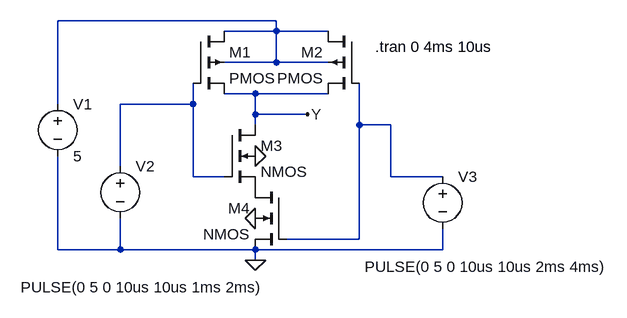
[diagram p0: schematic NAND2.asc]
NAND2.asc, the LTspice schematic file:
Version 4
SHEET 1 1060 680
WIRE 256 64 -80 64
WIRE 256 80 256 64
WIRE 256 80 176 80
WIRE 336 80 256 80
WIRE 256 128 256 80
WIRE 256 128 176 128
WIRE 336 128 256 128
WIRE 224 176 176 176
WIRE 336 176 224 176
WIRE -80 192 -80 64
WIRE 128 192 128 160
WIRE 128 192 16 192
WIRE 224 208 224 176
WIRE 304 208 224 208
WIRE 224 224 224 208
WIRE 384 224 384 160
WIRE 432 224 384 224
WIRE 16 288 16 192
WIRE 128 304 128 192
WIRE 176 304 128 304
WIRE 432 304 432 224
WIRE 512 304 432 304
WIRE 384 400 384 224
WIRE 384 400 272 400
WIRE -80 416 -80 272
WIRE 16 416 16 368
WIRE 16 416 -80 416
WIRE 224 416 16 416
WIRE 512 416 512 384
WIRE 512 416 224 416
WIRE 224 432 224 416
FLAG 224 432 0
FLAG 224 368 0
FLAG 224 272 0
FLAG 304 208 Y
SYMBOL pmos4 128 80 R0
SYMATTR InstName M1
SYMATTR Value2 l=2 w=10
SYMBOL pmos4 384 80 M0
SYMATTR InstName M2
SYMATTR Value2 l=2 w=10
SYMBOL nmos4 176 224 R0
SYMATTR InstName M3
SYMATTR Value2 l=2 w=10
SYMBOL nmos4 272 320 M0
SYMATTR InstName M4
SYMATTR Value2 l=2 w=10
SYMBOL voltage -80 176 R0
WINDOW 123 0 0 Left 2
WINDOW 39 0 0 Left 2
SYMATTR InstName V1
SYMATTR Value 5
SYMBOL voltage 512 288 R0
WINDOW 3 -120 154 Left 2
WINDOW 123 0 0 Left 2
WINDOW 39 0 0 Left 2
SYMATTR Value PULSE(0 5 0 10us 10us 2ms 4ms)
SYMATTR InstName V3
SYMBOL voltage 16 272 R0
WINDOW 3 -153 202 Left 2
WINDOW 123 0 0 Left 2
WINDOW 39 0 0 Left 2
SYMATTR Value PULSE(0 5 0 10us 10us 1ms 2ms)
SYMATTR InstName V2
TEXT 408 104 Left 2 !.tran 0 4ms 10us

The netlist it stands for:
* NAND2.asc
M1 N001 N002 Y N001 PMOS l=2 w=10
M2 N001 N003 Y N001 PMOS l=2 w=10
M3 Y N002 P001 0 NMOS l=2 w=10
M4 P001 N003 0 0 NMOS l=2 w=10
V1 N001 0 5
V3 N003 0 PULSE(0 5 0 10us 10us 2ms 4ms)
V2 N002 0 PULSE(0 5 0 10us 10us 1ms 2ms)
.model NMOS NMOS
.model PMOS PMOS
.lib standard.mos
.tran 0 4ms 10us
.backanno
.end